# Altium project Task_2.PrjPcb (part 4 of 5)
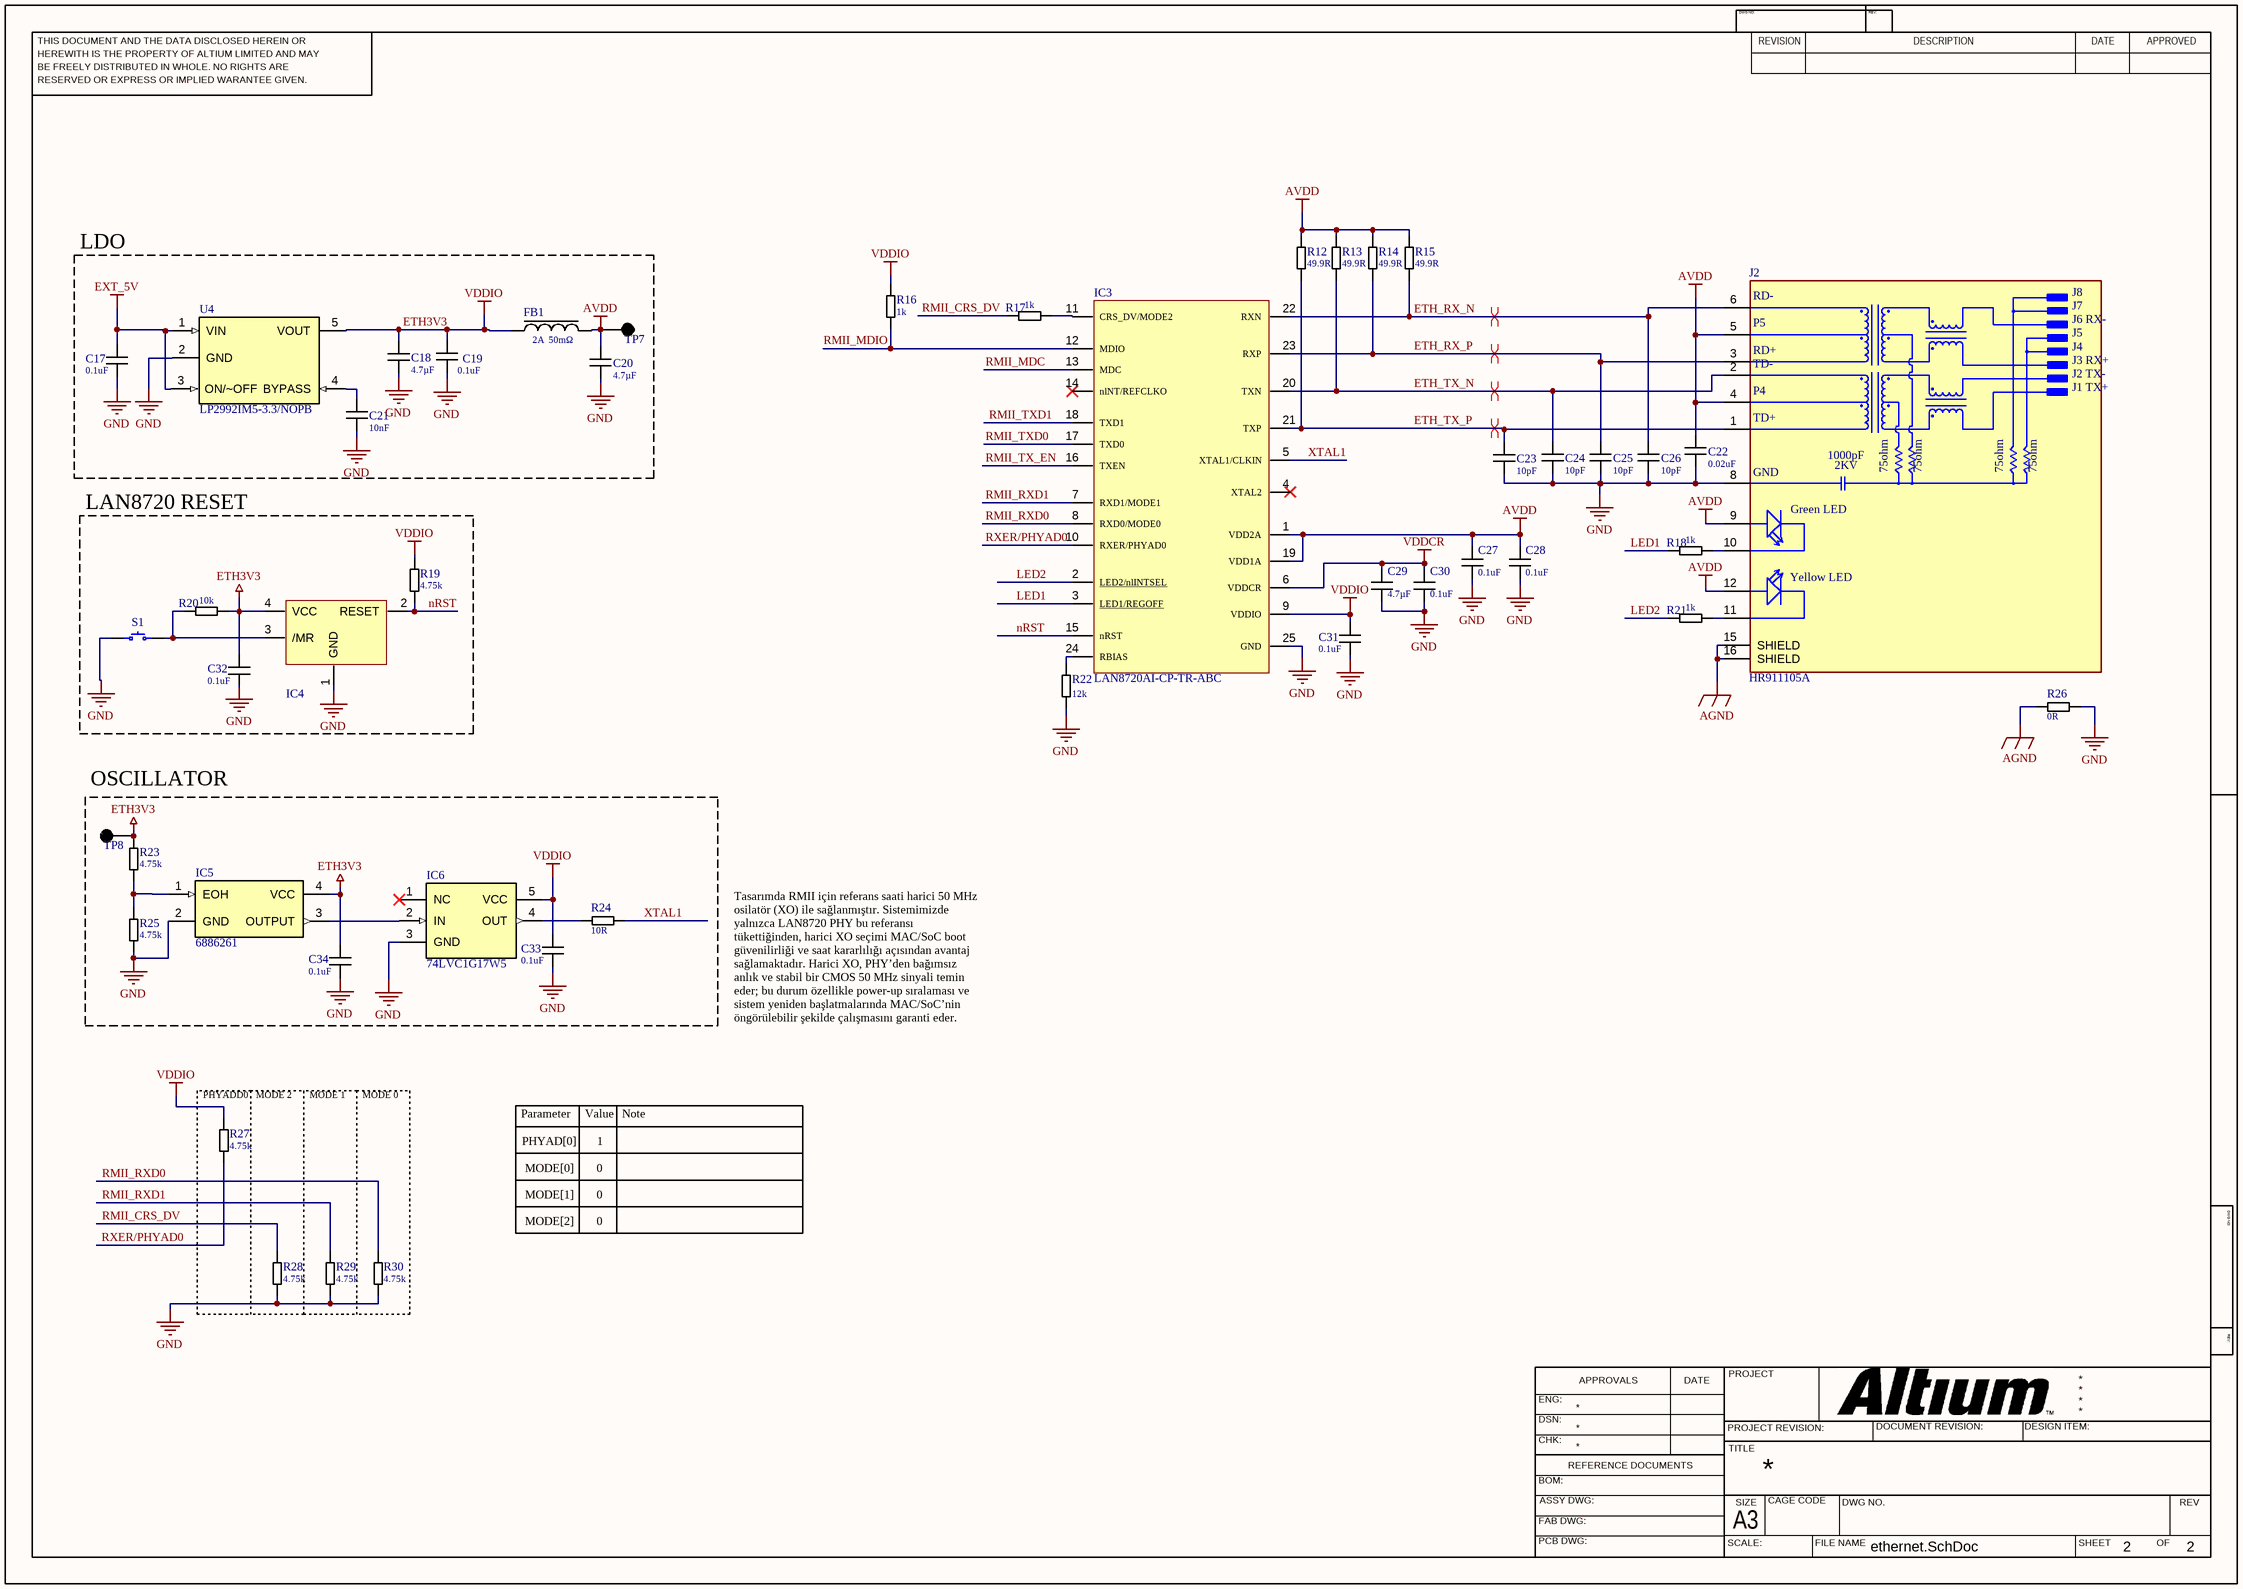
[diagram p4: ethernet.SchDoc]

## Sheet ethernet.SchDoc (continued)
### Library data of the parts
C17 C19 C27 C28 C30-C34 = CAP 0.1uF 0603: Cap Ceramic 0.1uF ±%10 10V SMD 0603; Manufacturer: KEMET; Dielectric: X7R; Dissipation Factor: 5%; Temperature Coefficient: 30ppm/°C; Tolerance: 10%; Supplier 1: Farnell; Manufacturer Part Number: C0603C104K8RACTU; RoHS: Compliant; Category: Ceramic Capacitors; Stock 1: 76000; Pricing 1: 4000=0,0182 (EUR); Case/Package: 0603; Case Code (Imperial): 0603; China RoHS: Compliant; Contact Plating: Tin; Depth: 800µm; Dielectric Material: Ceramic; Height: 800µm; Lead Free: Lead Free; Lead Pitch: 700µm; Length: 1.6mm; Lifecycle Status: Production; Material: Ceramic; Max Operating Temperature: 125°C; Min Operating Temperature: -55°C; Mount: Surface Mount; Number of Pins: 2; Number of Terminals: 2; Packaging: Tape & Reel; Radiation Hardening: No; REACH SVHC: Yes; Schedule B: 8532240020, 8532240020|8532240020, 8532240020|8532240020|8532240020, 8532240020|8532240020|8532240020|8532240020; Termination: SMD/SMT; Thickness: 863.6µm; Voltage: 10V; Voltage Rating: 10V; Voltage Rating (DC): 10V; Width: 800µm; ComponentLink1URL: https://datasheet.octopart.com:443/C0603C104K8RAC7867-KEMET-datasheet-179096319.pdf?src-supplier=IHS; ComponentLink1Description: https://datasheet.octopart.com:443/C0603C104K8RAC7867-KEMET-datasheet-179096319.pdf?src-supplier=IHS; ComponentLink2URL: https://datasheet.octopart.com:443/C0603C104K8RACTU-KEMET-datasheet-178445679.pdf?src-supplier=IHS; ComponentLink2Description: https://datasheet.octopart.com:443/C0603C104K8RACTU-KEMET-datasheet-178445679.pdf?src-supplier=IHS; ComponentLink3URL: https://datasheet.octopart.com:443/C0603C104K8RACTU-KEMET-datasheet-137357759.pdf?src-supplier=Farnell; ComponentLink3Description: https://datasheet.octopart.com:443/C0603C104K8RACTU-KEMET-datasheet-137357759.pdf?src-supplier=Farnell; ComponentLink4URL: https://datasheet.octopart.com:443/C0603C104K8RACTU-KEMET-datasheet-149521868.pdf?src-supplier=Farnell; ComponentLink4Description: https://datasheet.octopart.com:443/C0603C104K8RACTU-KEMET-datasheet-149521868.pdf?src-supplier=Farnell; ComponentLink5URL: https://datasheet.octopart.com:443/C0603C104K8RACTU-KEMET-datasheet-101575656.pdf?src-supplier=Farnell; ComponentLink5Description: https://datasheet.octopart.com:443/C0603C104K8RACTU-KEMET-datasheet-101575656.pdf?src-supplier=Farnell; ComponentLink6URL: https://datasheet.octopart.com:443/C0603C104K8RACTU-KEMET-datasheet-137357764.pdf?src-supplier=Upverter; ComponentLink6Description: https://datasheet.octopart.com:443/C0603C104K8RACTU-KEMET-datasheet-137357764.pdf?src-supplier=Upverter; ComponentLink7URL: https://datasheet.octopart.com:443/C0603C104K8RAC7867-KEMET-datasheet-188512054.pdf?src-supplier=ODG+(Origin+Data+Global); ComponentLink7Description: https://datasheet.octopart.com:443/C0603C104K8RAC7867-KEMET-datasheet-188512054.pdf?src-supplier=ODG+(Origin+Data+Global); ComponentLink8URL: https://datasheet.octopart.com:443/C0603C104K8RACTU-Kemet-datasheet-32036385.pdf?src-supplier=Electro+Sonic; ComponentLink8Description: https://datasheet.octopart.com:443/C0603C104K8RACTU-Kemet-datasheet-32036385.pdf?src-supplier=Electro+Sonic; ComponentLink9URL: https://datasheet.octopart.com:443/C0603C104K8RACTU-KEMET-datasheet-157246124.pdf?src-supplier=Electro+Sonic; ComponentLink9Description: https://datasheet.octopart.com:443/C0603C104K8RACTU-KEMET-datasheet-157246124.pdf?src-supplier=Electro+Sonic; ComponentLink10URL: https://datasheet.octopart.com:443/C0603C104K8RACTU-Kemet-datasheet-12608295.pdf?src-supplier=element14+APAC; ComponentLink10Description: https://datasheet.octopart.com:443/C0603C104K8RACTU-Kemet-datasheet-12608295.pdf?src-supplier=element14+APAC; ComponentLink11URL: https://datasheet.octopart.com:443/C0603C104K8RACTU-Kemet-datasheet-11992184.pdf?src-supplier=element14+APAC; ComponentLink11Description: https://datasheet.octopart.com:443/C0603C104K8RACTU-Kemet-datasheet-11992184.pdf?src-supplier=element14+APAC; ComponentLink12URL: https://datasheet.octopart.com:443/C0603C104K8RACTU-Kemet-datasheet-10942409.pdf?src-supplier=element14+APAC; ComponentLink12Description: https://datasheet.octopart.com:443/C0603C104K8RACTU-Kemet-datasheet-10942409.pdf?src-supplier=element14+APAC; ComponentLink13URL: https://datasheet.octopart.com:443/C0603C104K8RACTU-Kemet-datasheet-10404442.pdf?src-supplier=element14+APAC; ComponentLink13Description: https://datasheet.octopart.com:443/C0603C104K8RACTU-Kemet-datasheet-10404442.pdf?src-supplier=element14+APAC; ComponentLink14URL: https://datasheet.octopart.com:443/C0603C104K8RACTU-Kemet-datasheet-21133259.pdf?src-supplier=element14+APAC; ComponentLink14Description: https://datasheet.octopart.com:443/C0603C104K8RACTU-Kemet-datasheet-21133259.pdf?src-supplier=element14+APAC; ComponentLink15URL: https://datasheet.octopart.com:443/C0603C104K8RACTU-Kemet-datasheet-41232427.pdf?src-supplier=element14+APAC; ComponentLink15Description: https://datasheet.octopart.com:443/C0603C104K8RACTU-Kemet-datasheet-41232427.pdf?src-supplier=element14+APAC; ComponentLink16URL: https://datasheet.octopart.com:443/C0603C104K8RACTU-Kemet-datasheet-5313890.pdf?src-supplier=element14; ComponentLink16Description: https://datasheet.octopart.com:443/C0603C104K8RACTU-Kemet-datasheet-5313890.pdf?src-supplier=element14; ComponentLink17URL: https://datasheet.octopart.com:443/C0603C104K8RACTU-KEMET-datasheet-176142238.pdf?src-supplier=Newark; ComponentLink17Description: https://datasheet.octopart.com:443/C0603C104K8RACTU-KEMET-datasheet-176142238.pdf?src-supplier=Newark; ComponentLink18URL: https://datasheet.octopart.com:443/C0603C104K8RACTU-Kemet-datasheet-27203261.pdf?src-supplier=Newark; ComponentLink18Description: https://datasheet.octopart.com:443/C0603C104K8RACTU-Kemet-datasheet-27203261.pdf?src-supplier=Newark; ComponentLink19URL: https://datasheet.octopart.com:443/C0603C104K8RACTU-KEMET-datasheet-164512540.pdf?src-supplier=TME; ComponentLink19Description: https://datasheet.octopart.com:443/C0603C104K8RACTU-KEMET-datasheet-164512540.pdf?src-supplier=TME; ComponentLink20URL: https://datasheet.octopart.com:443/C0603C104K8RACTU-KEMET-datasheet-96931493.pdf?src-supplier=TME; ComponentLink20Description: https://datasheet.octopart.com:443/C0603C104K8RACTU-KEMET-datasheet-96931493.pdf?src-supplier=TME; ComponentLink21URL: https://datasheet.octopart.com:443/C0603C104K8RACTU-KEMET-datasheet-68331906.pdf?src-supplier=TME; ComponentLink21Description: https://datasheet.octopart.com:443/C0603C104K8RACTU-KEMET-datasheet-68331906.pdf?src-supplier=TME; ComponentLink22URL: https://datasheet.octopart.com:443/C0603C104K8RACTU-KEMET-datasheet-110724412.pdf?src-supplier=RS+(Formerly+Allied+Electronics); ComponentLink22Description: https://datasheet.octopart.com:443/C0603C104K8RACTU-KEMET-datasheet-110724412.pdf?src-supplier=RS+(Formerly+Allied+Electronics); ComponentLink23URL: https://datasheet.octopart.com:443/C0603C104K8RACTU-Kemet-datasheet-464.pdf?src-supplier=RS+(Formerly+Allied+Electronics); ComponentLink23Description: https://datasheet.octopart.com:443/C0603C104K8RACTU-Kemet-datasheet-464.pdf?src-supplier=RS+(Formerly+Allied+Electronics); ComponentLink24URL: https://datasheet.octopart.com/C0603C104K8RACTU-KEMET-datasheet-84169754.pdf; ComponentLink24Description: https://datasheet.octopart.com/C0603C104K8RACTU-KEMET-datasheet-84169754.pdf; ComponentLink25URL: https://datasheet.octopart.com:443/C0603C104K8RAC-TU-Kemet-datasheet-8204392.pdf?src-supplier=Jameco; ComponentLink25Description: https://datasheet.octopart.com:443/C0603C104K8RAC-TU-Kemet-datasheet-8204392.pdf?src-supplier=Jameco; Supplier Part Number 1: 2665559
C18 C20 C29 = CAP 4.7uF 0603: Cap Ceramic 4.7uF ±%10  10V SMD 0603; Manufacturer: Yageo Group; Dielectric: X5R; Tolerance: 10%; Supplier 1: Farnell; Manufacturer Part Number: CC0603KRX5R6BB475; RoHS: Compliant; Category: Ceramic Capacitors; Stock 1: 140000; Pricing 1: 4000=0,0354 (EUR); Case/Package: 0603; Case Code (Imperial): 0603; Case Code (Metric): 1608; China RoHS: Compliant; Composition: Ceramic; Depth: 800µm; Dielectric Material: Ceramic; Halogen Free: Halogen Free; Height: 800µm; Lead Free: Lead Free; Length: 1.6mm; Lifecycle Status: Production; Material: Ceramic; Max Operating Temperature: 85°C; Min Operating Temperature: -55°C; Mount: Surface Mount; Number of Pins: 2; Number of Terminals: 2; Radiation Hardening: No; REACH SVHC: Yes; Schedule B: 8532240020, 8532240020|8532240020|8532240020|8532240020|8532240020; Termination: SMD/SMT; Thickness: 889µm; Voltage Rating: 10V; Voltage Rating (DC): 10V; Width: 800µm; ComponentLink1URL: https://datasheet.octopart.com:443/CC0603KRX5R6BB475-Yageo-datasheet-170350636.pdf?src-supplier=IHS; ComponentLink1Description: https://datasheet.octopart.com:443/CC0603KRX5R6BB475-Yageo-datasheet-170350636.pdf?src-supplier=IHS; ComponentLink2URL: https://datasheet.octopart.com/CC0603KRX5R6BB475-Yageo-datasheet-86397281.pdf; ComponentLink2Description: https://datasheet.octopart.com/CC0603KRX5R6BB475-Yageo-datasheet-86397281.pdf; ComponentLink3URL: https://datasheet.octopart.com:443/CC0603KRX5R6BB475-Yageo-datasheet-82288757.pdf?src-supplier=Upverter; ComponentLink3Description: https://datasheet.octopart.com:443/CC0603KRX5R6BB475-Yageo-datasheet-82288757.pdf?src-supplier=Upverter; ComponentLink4URL: https://datasheet.octopart.com:443/CC0603KRX5R6BB475-Yageo-datasheet-10911834.pdf?src-supplier=element14+APAC; ComponentLink4Description: https://datasheet.octopart.com:443/CC0603KRX5R6BB475-Yageo-datasheet-10911834.pdf?src-supplier=element14+APAC; ComponentLink5URL: https://datasheet.octopart.com:443/CC0603KRX5R6BB475-Yageo-datasheet-62067349.pdf?src-supplier=element14+APAC; ComponentLink5Description: https://datasheet.octopart.com:443/CC0603KRX5R6BB475-Yageo-datasheet-62067349.pdf?src-supplier=element14+APAC; ComponentLink6URL: https://datasheet.octopart.com:443/CC0603KRX5R6BB475-Yageo-datasheet-181968526.pdf?src-supplier=Farnell; ComponentLink6Description: https://datasheet.octopart.com:443/CC0603KRX5R6BB475-Yageo-datasheet-181968526.pdf?src-supplier=Farnell; ComponentLink7URL: https://datasheet.octopart.com:443/CC0603KRX5R6BB475-Phycomp-datasheet-519481.pdf?src-supplier=Farnell; ComponentLink7Description: https://datasheet.octopart.com:443/CC0603KRX5R6BB475-Phycomp-datasheet-519481.pdf?src-supplier=Farnell; ComponentLink8URL: https://datasheet.octopart.com:443/CC0603KRX5R6BB475-Yageo-datasheet-158238148.pdf?src-supplier=Newark; ComponentLink8Description: https://datasheet.octopart.com:443/CC0603KRX5R6BB475-Yageo-datasheet-158238148.pdf?src-supplier=Newark; ComponentLink9URL: https://datasheet.octopart.com:443/CC0603KRX5R6BB475-Yageo-datasheet-8324442.pdf?src-supplier=Newark; ComponentLink9Description: https://datasheet.octopart.com:443/CC0603KRX5R6BB475-Yageo-datasheet-8324442.pdf?src-supplier=Newark; ComponentLink10URL: https://datasheet.octopart.com:443/CC0603KRX5R6BB475-Yageo-datasheet-149070021.pdf?src-supplier=TME; ComponentLink10Description: https://datasheet.octopart.com:443/CC0603KRX5R6BB475-Yageo-datasheet-149070021.pdf?src-supplier=TME; ComponentLink11URL: https://datasheet.octopart.com:443/CC0603KRX5R6BB475-Yageo-Group-datasheet-145016144.pdf?src-supplier=ODG+(Origin+Data+Global); ComponentLink11Description: https://datasheet.octopart.com:443/CC0603KRX5R6BB475-Yageo-Group-datasheet-145016144.pdf?src-supplier=ODG+(Origin+Data+Global); ComponentLink12URL: https://datasheet.octopart.com:443/CC0603KRX5R6BB475-Yageo-datasheet-137875056.pdf?src-supplier=Future+Electronics; ComponentLink12Description: https://datasheet.octopart.com:443/CC0603KRX5R6BB475-Yageo-datasheet-137875056.pdf?src-supplier=Future+Electronics; ComponentLink13URL: https://datasheet.octopart.com:443/CC0603KRX5R6BB475-Yageo-datasheet-137700082.pdf?src-supplier=Future+Electronics; ComponentLink13Description: https://datasheet.octopart.com:443/CC0603KRX5R6BB475-Yageo-datasheet-137700082.pdf?src-supplier=Future+Electronics; ComponentLink14URL: https://datasheet.octopart.com:443/CC0603KRX5R6BB475-Yageo-datasheet-137700085.pdf?src-supplier=Future+Electronics; ComponentLink14Description: https://datasheet.octopart.com:443/CC0603KRX5R6BB475-Yageo-datasheet-137700085.pdf?src-supplier=Future+Electronics; ComponentLink15URL: https://datasheet.octopart.com:443/CC0603KRX5R6BB475-Yageo-datasheet-59875459.pdf?src-supplier=Future+Electronics; ComponentLink15Description: https://datasheet.octopart.com:443/CC0603KRX5R6BB475-Yageo-datasheet-59875459.pdf?src-supplier=Future+Electronics; ComponentLink16URL: https://datasheet.octopart.com:443/CC0603KRX5R6BB475-Yageo-datasheet-27626583.pdf?src-supplier=Future+Electronics; ComponentLink16Description: https://datasheet.octopart.com:443/CC0603KRX5R6BB475-Yageo-datasheet-27626583.pdf?src-supplier=Future+Electronics; ComponentLink17URL: https://datasheet.octopart.com:443/CC0603KRX5R6BB475-Yageo-datasheet-15895757.pdf?src-supplier=Future+Electronics; ComponentLink17Description: https://datasheet.octopart.com:443/CC0603KRX5R6BB475-Yageo-datasheet-15895757.pdf?src-supplier=Future+Electronics; ComponentLink18URL: https://datasheet.octopart.com:443/CC0603KRX5R6BB475-Yageo-datasheet-14389981.pdf?src-supplier=Future+Electronics; ComponentLink18Description: https://datasheet.octopart.com:443/CC0603KRX5R6BB475-Yageo-datasheet-14389981.pdf?src-supplier=Future+Electronics; ComponentLink19URL: http://sigma.octopart.com:80/rohs_statement/Yageo-company-2.pdf?src-supplier=Compliance+Statements; ComponentLink19Description: http://sigma.octopart.com:80/rohs_statement/Yageo-company-2.pdf?src-supplier=Compliance+Statements; ComponentLink20URL: http://sigma.octopart.com:80/conflict_mineral_statement/Yageo-company-3.pdf?src-supplier=Compliance+Statements; ComponentLink20Description: http://sigma.octopart.com:80/conflict_mineral_statement/Yageo-company-3.pdf?src-supplier=Compliance+Statements; Supplier Part Number 1: 3871732
C21 = CAP 0.01uF 0603: Cap Ceramic 0.01uF ±%20 50V SMD 0603; Manufacturer: KYOCERA AVX; Dielectric: X7R; Dissipation Factor: 2.5%; Tolerance: 20%; Supplier 1: Mouser; Manufacturer Part Number: 06035C103MAZ2A; RoHS: Compliant; Category: Ceramic Capacitors; Stock 1: 17787; Pricing 1: 1=0,1, 10=0,029, 50=0,029, 100=0,025, 1000=0,016, 10000=0,010 (USD); Case/Package: 0603; Case Code (Imperial): 0603; Case Code (Metric): 1608; China RoHS: Compliant; Dielectric Material: Ceramic; Height: 900µm; Length: 1.6mm; Lifecycle Status: Production; Material: Ceramic; Max Operating Temperature: 125°C; Min Operating Temperature: -55°C; Mount: Surface Mount; Number of Terminals: 2; REACH SVHC: Yes; Schedule B: 8532240020; Termination: SMD/SMT; Voltage Rating: 50V; Voltage Rating (DC): 50V; Width: 810µm; ComponentLink1URL: https://datasheet.octopart.com:443/06035C103MAZ2A-KYOCERA-AVX-datasheet-170560559.pdf?src-supplier=IHS; ComponentLink1Description: https://datasheet.octopart.com:443/06035C103MAZ2A-KYOCERA-AVX-datasheet-170560559.pdf?src-supplier=IHS; ComponentLink2URL: https://sigma.octopart.com:443/147443767/technical_drawing/AVX-06035C103MAZ2A.pdf?src-supplier=Upverter; ComponentLink2Description: https://sigma.octopart.com:443/147443767/technical_drawing/AVX-06035C103MAZ2A.pdf?src-supplier=Upverter; ComponentLink3URL: https://datasheet.octopart.com:443/06035C103MAZ2A-KYOCERA-AVX-datasheet-156093841.pdf?src-supplier=Future+Electronics; ComponentLink3Description: https://datasheet.octopart.com:443/06035C103MAZ2A-KYOCERA-AVX-datasheet-156093841.pdf?src-supplier=Future+Electronics; ComponentLink4URL: https://datasheet.octopart.com/06035C103MAZ2A-KYOCERA-AVX-datasheet-13516023.pdf; ComponentLink4Description: https://datasheet.octopart.com/06035C103MAZ2A-KYOCERA-AVX-datasheet-13516023.pdf; ComponentLink5URL: https://datasheet.octopart.com/Commercial-Surface-Mount-Chips---X7R-Dielectric-AVX-datasheet-family-100.pdf; ComponentLink5Description: https://datasheet.octopart.com/Commercial-Surface-Mount-Chips---X7R-Dielectric-AVX-datasheet-family-100.pdf; ComponentLink6URL: http://sigma.octopart.com:80/reach_statement/AVX-company-19.pdf?src-supplier=Compliance+Statements; ComponentLink6Description: http://sigma.octopart.com:80/reach_statement/AVX-company-19.pdf?src-supplier=Compliance+Statements; ComponentLink7URL: http://sigma.octopart.com:80/conflict_mineral_statement/AVX-company-34.pdf?src-supplier=Compliance+Statements; ComponentLink7Description: http://sigma.octopart.com:80/conflict_mineral_statement/AVX-company-34.pdf?src-supplier=Compliance+Statements; Supplier Part Number 1: 581-06035C103MAZ2A
C22 = CAP 0.02uF 0603: Cap Ceramic 0.02 uF 10 V ±%10 SMD 0603; Manufacturer: KYOCERA AVX; Manufacturer Part Number: 0603ZC223KAT2A; Dielectric: X7R; Dissipation Factor: 5%; Tolerance: 10%; Voltage Rating: 10V; Supplier 1: Future Electronics; RoHS: Compliant; Category: Ceramic Capacitors; Stock 1: 68000; Pricing 1: 4000=0,0057, 16000=0,0055, 40000=0,0053, 100000=0,0052, 160000=0,0049 (USD); Case/Package: 0603; Case Code (Imperial): 0603; Case Code (Metric): 1608; China RoHS: Compliant; Depth: 810µm; Dielectric Material: Ceramic; Height: 900µm; Lead Free: Lead Free; Length: 1.6mm; Lifecycle Status: Production; Max Operating Temperature: 125°C; Min Operating Temperature: -55°C; Mount: Surface Mount; Number of Pins: 2; Number of Terminals: 2; Radiation Hardening: No; REACH SVHC: Yes; Schedule B: 8532240020; Termination: SMD/SMT; Thickness: 889µm; Voltage Rating (DC): 10V; Width: 810µm; ComponentLink1URL: https://datasheet.octopart.com:443/0603ZC223KAT2A-KYOCERA-AVX-datasheet-170560559.pdf?src-supplier=IHS; ComponentLink1Description: https://datasheet.octopart.com:443/0603ZC223KAT2A-KYOCERA-AVX-datasheet-170560559.pdf?src-supplier=IHS; ComponentLink2URL: https://datasheet.octopart.com:443/0603ZC223KAT2A-KYOCERA-AVX-datasheet-158983632.pdf?src-supplier=Newark; ComponentLink2Description: https://datasheet.octopart.com:443/0603ZC223KAT2A-KYOCERA-AVX-datasheet-158983632.pdf?src-supplier=Newark; ComponentLink3URL: https://datasheet.octopart.com:443/0603ZC223KAT2A-AVX-datasheet-78690206.pdf?src-supplier=Newark; ComponentLink3Description: https://datasheet.octopart.com:443/0603ZC223KAT2A-AVX-datasheet-78690206.pdf?src-supplier=Newark; ComponentLink4URL: https://datasheet.octopart.com:443/0603ZC223KAT2A-KYOCERA-AVX-datasheet-8447489.pdf?src-supplier=Newark; ComponentLink4Description: https://datasheet.octopart.com:443/0603ZC223KAT2A-KYOCERA-AVX-datasheet-8447489.pdf?src-supplier=Newark; ComponentLink5URL: https://datasheet.octopart.com:443/0603ZC223KAT2A-KYOCERA-AVX-datasheet-50865067.pdf?src-supplier=Future+Electronics; ComponentLink5Description: https://datasheet.octopart.com:443/0603ZC223KAT2A-KYOCERA-AVX-datasheet-50865067.pdf?src-supplier=Future+Electronics; ComponentLink6URL: https://datasheet.octopart.com:443/0603ZC223KAT2A-AVX-datasheet-12587061.pdf?src-supplier=Future+Electronics; ComponentLink6Description: https://datasheet.octopart.com:443/0603ZC223KAT2A-AVX-datasheet-12587061.pdf?src-supplier=Future+Electronics; ComponentLink7URL: https://datasheet.octopart.com:443/0603ZC223KAT2A-AVX-datasheet-12509786.pdf?src-supplier=Future+Electronics; ComponentLink7Description: https://datasheet.octopart.com:443/0603ZC223KAT2A-AVX-datasheet-12509786.pdf?src-supplier=Future+Electronics; ComponentLink8URL: https://datasheet.octopart.com:443/0603ZC223KAT2A-AVX-datasheet-8113618.pdf?src-supplier=Future+Electronics; ComponentLink8Description: https://datasheet.octopart.com:443/0603ZC223KAT2A-AVX-datasheet-8113618.pdf?src-supplier=Future+Electronics; ComponentLink9URL: https://datasheet.octopart.com:443/0603ZC223KAT2A-AVX-datasheet-5313617.pdf?src-supplier=Future+Electronics; ComponentLink9Description: https://datasheet.octopart.com:443/0603ZC223KAT2A-AVX-datasheet-5313617.pdf?src-supplier=Future+Electronics; ComponentLink10URL: https://datasheet.octopart.com:443/0603ZC223KAT2A-AVX-datasheet-167033.pdf?src-supplier=Future+Electronics; ComponentLink10Description: https://datasheet.octopart.com:443/0603ZC223KAT2A-AVX-datasheet-167033.pdf?src-supplier=Future+Electronics; ComponentLink11URL: https://datasheet.octopart.com/0603ZC223KAT2A-AVX---Kyocera-datasheet-13516023.pdf; ComponentLink11Description: https://datasheet.octopart.com/0603ZC223KAT2A-AVX---Kyocera-datasheet-13516023.pdf; ComponentLink12URL: https://datasheet.octopart.com:443/0603ZC223KAT2A-AVX-datasheet-111406.pdf?src-supplier=Sierra+IC; ComponentLink12Description: https://datasheet.octopart.com:443/0603ZC223KAT2A-AVX-datasheet-111406.pdf?src-supplier=Sierra+IC; ComponentLink13URL: http://sigma.octopart.com:80/reach_statement/AVX-company-19.pdf?src-supplier=Compliance+Statements; ComponentLink13Description: http://sigma.octopart.com:80/reach_statement/AVX-company-19.pdf?src-supplier=Compliance+Statements; ComponentLink14URL: http://sigma.octopart.com:80/conflict_mineral_statement/AVX-company-34.pdf?src-supplier=Compliance+Statements; ComponentLink14Description: http://sigma.octopart.com:80/conflict_mineral_statement/AVX-company-34.pdf?src-supplier=Compliance+Statements; Supplier Part Number 1: 8054082
C23-C26 = CAP 10pF 0603: Cap Ceramic 10pF  ±5 50V SMD 0603; Manufacturer: Yageo Group; Dielectric: C0G; Insulation Resistance: 100GΩ; Temperature Coefficient: 30ppm/°C; Tolerance: 5%; Supplier 1: Farnell; Manufacturer Part Number: CC0603JRNPO9BN100; RoHS: Compliant; Category: Ceramic Capacitors; Stock 1: 1398662; Pricing 1: 10=0,0182, 100=0,0156, 500=0,0113, 1000=0,0087, 2000=0,0082, 4000=0,0077 (EUR); Case/Package: 0603; Case Code (Imperial): 0603; Case Code (Metric): 1608; China RoHS: Compliant; Composition: Ceramic; Depth: 800µm; Dielectric Material: Ceramic; Halogen Free: Halogen Free; Height: 800µm; Lead Free: Lead Free; Length: 1.6mm; Lifecycle Status: Production; Max Operating Temperature: 125°C; Min Operating Temperature: -55°C; Mount: Surface Mount; Number of Pins: 2; Number of Terminals: 2; Radiation Hardening: No; REACH SVHC: Yes; Schedule B: 8532240020, 8532240020|8532240020, 8532240020|8532240020|8532240020, 8532240020|8532240020|8532240020|8532240020; Termination: SMD/SMT; Thickness: 889µm; Voltage: 50V; Voltage Rating: 50V; Voltage Rating (DC): 50V; Width: 800µm; ComponentLink1URL: https://datasheet.octopart.com:443/CC0603JRNPO9BN100-Yageo-datasheet-182140217.pdf?src-supplier=IHS; ComponentLink1Description: https://datasheet.octopart.com:443/CC0603JRNPO9BN100-Yageo-datasheet-182140217.pdf?src-supplier=IHS; ComponentLink2URL: https://datasheet.octopart.com:443/CC0603JRNPO9BN100-Yageo-datasheet-78855684.pdf?src-supplier=Upverter; ComponentLink2Description: https://datasheet.octopart.com:443/CC0603JRNPO9BN100-Yageo-datasheet-78855684.pdf?src-supplier=Upverter; ComponentLink3URL: https://datasheet.octopart.com:443/CC0603JRNPO9BN100-Yageo-datasheet-10406438.pdf?src-supplier=element14+APAC; ComponentLink3Description: https://datasheet.octopart.com:443/CC0603JRNPO9BN100-Yageo-datasheet-10406438.pdf?src-supplier=element14+APAC; ComponentLink4URL: https://datasheet.octopart.com:443/CC0603JRNPO9BN100-Yageo-datasheet-151948684.pdf?src-supplier=element14+APAC; ComponentLink4Description: https://datasheet.octopart.com:443/CC0603JRNPO9BN100-Yageo-datasheet-151948684.pdf?src-supplier=element14+APAC; ComponentLink5URL: https://datasheet.octopart.com:443/CC0603JRNPO9BN100-Yageo-datasheet-65873193.pdf?src-supplier=element14+APAC; ComponentLink5Description: https://datasheet.octopart.com:443/CC0603JRNPO9BN100-Yageo-datasheet-65873193.pdf?src-supplier=element14+APAC; ComponentLink6URL: https://datasheet.octopart.com:443/CC0603JRNPO9BN100-Yageo-datasheet-67645495.pdf?src-supplier=element14+APAC; ComponentLink6Description: https://datasheet.octopart.com:443/CC0603JRNPO9BN100-Yageo-datasheet-67645495.pdf?src-supplier=element14+APAC; ComponentLink7URL: https://datasheet.octopart.com:443/CC0603JRNPO9BN100-Yageo-datasheet-10882999.pdf?src-supplier=element14+APAC; ComponentLink7Description: https://datasheet.octopart.com:443/CC0603JRNPO9BN100-Yageo-datasheet-10882999.pdf?src-supplier=element14+APAC; ComponentLink8URL: https://datasheet.octopart.com:443/CC0603JRNPO9BN100-Yageo-datasheet-504625.pdf?src-supplier=Newark; ComponentLink8Description: https://datasheet.octopart.com:443/CC0603JRNPO9BN100-Yageo-datasheet-504625.pdf?src-supplier=Newark; ComponentLink9URL: https://datasheet.octopart.com:443/CC0603JRNPO9BN100-Yageo-datasheet-181968161.pdf?src-supplier=Newark; ComponentLink9Description: https://datasheet.octopart.com:443/CC0603JRNPO9BN100-Yageo-datasheet-181968161.pdf?src-supplier=Newark; ComponentLink10URL: https://datasheet.octopart.com:443/CC0603JRNPO9BN100-Yageo-datasheet-181968159.pdf?src-supplier=Newark; ComponentLink10Description: https://datasheet.octopart.com:443/CC0603JRNPO9BN100-Yageo-datasheet-181968159.pdf?src-supplier=Newark; ComponentLink11URL: https://datasheet.octopart.com:443/CC0603JRNPO9BN100-Yageo-datasheet-5321569.pdf?src-supplier=Newark; ComponentLink11Description: https://datasheet.octopart.com:443/CC0603JRNPO9BN100-Yageo-datasheet-5321569.pdf?src-supplier=Newark; ComponentLink12URL: https://datasheet.octopart.com:443/CC0603JRNPO9BN100-Yageo-datasheet-137875056.pdf?src-supplier=Future+Electronics; ComponentLink12Description: https://datasheet.octopart.com:443/CC0603JRNPO9BN100-Yageo-datasheet-137875056.pdf?src-supplier=Future+Electronics; ComponentLink13URL: https://datasheet.octopart.com:443/CC0603JRNPO9BN100-Yageo-datasheet-136957424.pdf?src-supplier=Future+Electronics; ComponentLink13Description: https://datasheet.octopart.com:443/CC0603JRNPO9BN100-Yageo-datasheet-136957424.pdf?src-supplier=Future+Electronics; ComponentLink14URL: https://datasheet.octopart.com:443/CC0603JRNPO9BN100-Yageo-datasheet-137700082.pdf?src-supplier=Future+Electronics; ComponentLink14Description: https://datasheet.octopart.com:443/CC0603JRNPO9BN100-Yageo-datasheet-137700082.pdf?src-supplier=Future+Electronics; ComponentLink15URL: https://datasheet.octopart.com:443/CC0603JRNPO9BN100-Yageo-datasheet-62091628.pdf?src-supplier=Future+Electronics; ComponentLink15Description: https://datasheet.octopart.com:443/CC0603JRNPO9BN100-Yageo-datasheet-62091628.pdf?src-supplier=Future+Electronics; ComponentLink16URL: https://datasheet.octopart.com:443/CC0603JRNPO9BN100-Yageo-datasheet-24578986.pdf?src-supplier=Future+Electronics; ComponentLink16Description: https://datasheet.octopart.com:443/CC0603JRNPO9BN100-Yageo-datasheet-24578986.pdf?src-supplier=Future+Electronics; ComponentLink17URL: https://datasheet.octopart.com:443/CC0603JRNPO9BN100-Yageo-datasheet-16730043.pdf?src-supplier=Future+Electronics; ComponentLink17Description: https://datasheet.octopart.com:443/CC0603JRNPO9BN100-Yageo-datasheet-16730043.pdf?src-supplier=Future+Electronics; ComponentLink18URL: https://datasheet.octopart.com:443/CC0603JRNPO9BN100-Yageo-datasheet-15895757.pdf?src-supplier=Future+Electronics; ComponentLink18Description: https://datasheet.octopart.com:443/CC0603JRNPO9BN100-Yageo-datasheet-15895757.pdf?src-supplier=Future+Electronics; ComponentLink19URL: https://datasheet.octopart.com:443/CC0603JRNPO9BN100-Yageo-datasheet-12589826.pdf?src-supplier=Future+Electronics; ComponentLink19Description: https://datasheet.octopart.com:443/CC0603JRNPO9BN100-Yageo-datasheet-12589826.pdf?src-supplier=Future+Electronics; ComponentLink20URL: https://datasheet.octopart.com:443/CC0603JRNPO9BN100-Yageo-Group-datasheet-188689709.pdf?src-supplier=Farnell; ComponentLink20Description: https://datasheet.octopart.com:443/CC0603JRNPO9BN100-Yageo-Group-datasheet-188689709.pdf?src-supplier=Farnell; ComponentLink21URL: https://datasheet.octopart.com:443/CC0603JRNPO9BN100-Yageo-datasheet-8817079.pdf?src-supplier=element14; ComponentLink21Description: https://datasheet.octopart.com:443/CC0603JRNPO9BN100-Yageo-datasheet-8817079.pdf?src-supplier=element14; ComponentLink22URL: https://datasheet.octopart.com:443/CC0603JRNPO9BN100-Yageo-datasheet-8324240.pdf?src-supplier=element14; ComponentLink22Description: https://datasheet.octopart.com:443/CC0603JRNPO9BN100-Yageo-datasheet-8324240.pdf?src-supplier=element14; ComponentLink23URL: https://datasheet.octopart.com:443/CC0603JRNPO9BN100-Yageo-datasheet-8643175.pdf?src-supplier=SOS+electronic; ComponentLink23Description: https://datasheet.octopart.com:443/CC0603JRNPO9BN100-Yageo-datasheet-8643175.pdf?src-supplier=SOS+electronic; ComponentLink24URL: https://datasheet.octopart.com:443/CC0603JRNPO9BN100-Yageo-datasheet-8555986.pdf?src-supplier=TME; ComponentLink24Description: https://datasheet.octopart.com:443/CC0603JRNPO9BN100-Yageo-datasheet-8555986.pdf?src-supplier=TME; ComponentLink25URL: https://datasheet.octopart.com:443/CC0603JRNPO9BN100-Yageo-datasheet-68296204.pdf?src-supplier=Megastar; ComponentLink25Description: https://datasheet.octopart.com:443/CC0603JRNPO9BN100-Yageo-datasheet-68296204.pdf?src-supplier=Megastar; ComponentLink26URL: http://sigma.octopart.com:80/rohs_statement/Yageo-company-2.pdf?src-supplier=Compliance+Statements; ComponentLink26Description: http://sigma.octopart.com:80/rohs_statement/Yageo-company-2.pdf?src-supplier=Compliance+Statements; ComponentLink27URL: http://sigma.octopart.com:80/conflict_mineral_statement/Yageo-company-3.pdf?src-supplier=Compliance+Statements; ComponentLink27Description: http://sigma.octopart.com:80/conflict_mineral_statement/Yageo-company-3.pdf?src-supplier=Compliance+Statements; Supplier Part Number 1: 721967
FB1 = Ferrite Bead 0603 - 120Ohms 2A 50mOhm: Ferrite Beads Multi-Layer 120Ohm 25% 100MHz 2A 50mOhm DCR 0603 Paper T/R; Manufacturer: Murata; Current Rating: 1A; Impedance: 120Ω; Material: Ferrite, Steel; Number of Circuits: 1; Shielding: Unshielded; Supplier 1: Arrow Electronics; Manufacturer Part Number: BLM18PG121SN1D; RoHS: Compliant; Category: Ferrite Beads and Chips; Stock 1: 924000; Pricing 1: 4000=0,0193, 8000=0,016 (USD); Case/Package: 0603; Case Code (Imperial): 0603; Case Code (Metric): 1608; Core Material: Ferrite; Depth: 800µm; Frequency: 100MHz; Height: 800µm; Lead Free: Lead Free; Length: 1.6mm; Lifecycle Status: Production; Max Current Rating: 2A; Max DC Current: 2A; Max Frequency: 100MHz; Max Operating Temperature: 125°C; Min Operating Temperature: -55°C; Number of Lines: 1; Number of Pins: 2; Number of Terminals: 2; Packaging: Cut Tape; Radiation Hardening: No; REACH SVHC: Yes; Resistance: 50mΩ; RMS Current (Irms): 2A; Schedule B: 8504500000, 8504500000|8504500000|8504500000|8504500000|8504500000; Series Resistance: 50mΩ; Termination: SMD/SMT; Test Frequency: 100MHz; Tolerance: 25%; Width: 800µm; ComponentLink1URL: https://datasheet.octopart.com:443/BLM18PG121SN1D-Murata-datasheet-180806579.pdf?src-supplier=IHS; ComponentLink1Description: https://datasheet.octopart.com:443/BLM18PG121SN1D-Murata-datasheet-180806579.pdf?src-supplier=IHS; ComponentLink2URL: https://datasheet.octopart.com:443/BLM18PG121SN1D-Murata-datasheet-35449.pdf?src-supplier=Upverter; ComponentLink2Description: https://datasheet.octopart.com:443/BLM18PG121SN1D-Murata-datasheet-35449.pdf?src-supplier=Upverter; ComponentLink3URL: https://datasheet.octopart.com:443/BLM18PG121SN1D-Murata-datasheet-141439065.pdf?src-supplier=Upverter; ComponentLink3Description: https://datasheet.octopart.com:443/BLM18PG121SN1D-Murata-datasheet-141439065.pdf?src-supplier=Upverter; ComponentLink4URL: https://datasheet.octopart.com:443/BLM18PG121SN1D-Murata-datasheet-11754816.pdf?src-supplier=element14+APAC; ComponentLink4Description: https://datasheet.octopart.com:443/BLM18PG121SN1D-Murata-datasheet-11754816.pdf?src-supplier=element14+APAC; ComponentLink5URL: https://datasheet.octopart.com:443/BLM18PG121SN1D-Murata-datasheet-8326388.pdf?src-supplier=_legacy+Avnet; ComponentLink5Description: https://datasheet.octopart.com:443/BLM18PG121SN1D-Murata-datasheet-8326388.pdf?src-supplier=_legacy+Avnet; ComponentLink6URL: https://datasheet.octopart.com:443/BLM18PG121SN1D-Murata-datasheet-503348.pdf?src-supplier=_legacy+Avnet; ComponentLink6Description: https://datasheet.octopart.com:443/BLM18PG121SN1D-Murata-datasheet-503348.pdf?src-supplier=_legacy+Avnet; ComponentLink7URL: https://datasheet.octopart.com:443/BLM18PG121SN1D-Murata-datasheet-141258021.pdf?src-supplier=Ciiva; ComponentLink7Description: https://datasheet.octopart.com:443/BLM18PG121SN1D-Murata-datasheet-141258021.pdf?src-supplier=Ciiva; ComponentLink8URL: https://datasheet.octopart.com:443/BLM18PG121SN1D-Murata-datasheet-138707164.pdf?src-supplier=Ciiva; ComponentLink8Description: https://datasheet.octopart.com:443/BLM18PG121SN1D-Murata-datasheet-138707164.pdf?src-supplier=Ciiva; ComponentLink9URL: https://datasheet.octopart.com:443/BLM18PG121SN1D-Murata-datasheet-135086698.pdf?src-supplier=TME; ComponentLink9Description: https://datasheet.octopart.com:443/BLM18PG121SN1D-Murata-datasheet-135086698.pdf?src-supplier=TME; ComponentLink10URL: https://datasheet.octopart.com:443/BLM18PG121SN1D-Murata-datasheet-62117746.pdf?src-supplier=TME; ComponentLink10Description: https://datasheet.octopart.com:443/BLM18PG121SN1D-Murata-datasheet-62117746.pdf?src-supplier=TME; ComponentLink11URL: https://datasheet.octopart.com:443/BLM18PG121SN1D-Murata-datasheet-120101182.pdf?src-supplier=Megastar; ComponentLink11Description: https://datasheet.octopart.com:443/BLM18PG121SN1D-Murata-datasheet-120101182.pdf?src-supplier=Megastar; ComponentLink12URL: https://datasheet.octopart.com:443/BLM18PG121SN1D-Murata-datasheet-78375072.pdf?src-supplier=Future+Electronics; ComponentLink12Description: https://datasheet.octopart.com:443/BLM18PG121SN1D-Murata-datasheet-78375072.pdf?src-supplier=Future+Electronics; ComponentLink13URL: https://datasheet.octopart.com:443/BLM18PG121SN1D-Murata-datasheet-62086336.pdf?src-supplier=Future+Electronics; ComponentLink13Description: https://datasheet.octopart.com:443/BLM18PG121SN1D-Murata-datasheet-62086336.pdf?src-supplier=Future+Electronics; ComponentLink14URL: https://datasheet.octopart.com/BLM18PG121SN1D-Murata-datasheet-37129980.pdf; ComponentLink14Description: https://datasheet.octopart.com/BLM18PG121SN1D-Murata-datasheet-37129980.pdf; ComponentLink15URL: https://datasheet.octopart.com:443/BLM18PG121SN1D-Murata-datasheet-14066459.pdf?src-supplier=iiiC; ComponentLink15Description: https://datasheet.octopart.com:443/BLM18PG121SN1D-Murata-datasheet-14066459.pdf?src-supplier=iiiC; ComponentLink16URL: https://datasheet.octopart.com:443/BLM18PG121SN1D-Murata-datasheet-5394615.pdf?src-supplier=Verical; ComponentLink16Description: https://datasheet.octopart.com:443/BLM18PG121SN1D-Murata-datasheet-5394615.pdf?src-supplier=Verical; ComponentLink17URL: https://datasheet.octopart.com:443/BLM18PG121SN1D-Murata-datasheet-7623654.pdf?src-supplier=Jameco; ComponentLink17Description: https://datasheet.octopart.com:443/BLM18PG121SN1D-Murata-datasheet-7623654.pdf?src-supplier=Jameco; ComponentLink18URL: https://datasheet.octopart.com:443/BLM18PG121SN1D-Murata-datasheet-41253.pdf?src-supplier=RS+(Formerly+Allied+Electronics); ComponentLink18Description: https://datasheet.octopart.com:443/BLM18PG121SN1D-Murata-datasheet-41253.pdf?src-supplier=RS+(Formerly+Allied+Electronics); ComponentLink19URL: http://sigma.octopart.com:80/reach_statement/Murata-company-16.pdf?src-supplier=Compliance+Statements; ComponentLink19Description: http://sigma.octopart.com:80/reach_statement/Murata-company-16.pdf?src-supplier=Compliance+Statements; Supplier Part Number 1: BLM18PG121SN1D
IC3 = LAN8720AI-CP-TR-ABC: Small Footprint MII/RMII 10/100 Ethernet Transceiver with flexPWR Technology; Manufacturer: Microchip; Manufacturer Package Identifier: 24-S4QFN-4x4B-0.5P; Data Rate: 100Mbps; Max Supply Current: 21mA; Max Supply Voltage: 3.6V; Min Supply Voltage: 1.08V; Number of Channels: 1; Operating Supply Voltage: 1.2V; Simplex/Duplex: Full Duplex; Supplier 1: Arrow Electronics; Manufacturer Part Number: LAN8720AI-CP-TR-ABC; RoHS: Compliant; Category: Ethernet Interface ICs; Stock 1: 10000; Pricing 1: 5000=0,9425 (USD); Projected EOL Date: 2039-02-06; Ambient Temperature Range High: 85°C; Case/Package: QFN; Country of Assembly: Taiwan, Thailand; Country of Fabrication: Singapore; Country of Origin: Taiwan, Thailand; Export Control Classification Number (ECCN) Code: EAR99; Height: 1mm; Harmonized Tariff Schedule (HTS) Code: 8542.39.0060; Interface: Ethernet; Lifecycle Status: Production; Max Operating Temperature: 85°C; Min Operating Temperature: 0°C; Mount: Surface Mount; Number of Pins: 24; Number of Transceivers: 1; Packaging: Tape & Reel (TR); Weight: 928.191737mg; ComponentLink1URL: https://datasheet.octopart.com:443/LAN8720AI-CP-TR-ABC-Microchip-datasheet-78862000.pdf?src-supplier=Microchip; ComponentLink1Description: https://datasheet.octopart.com:443/LAN8720AI-CP-TR-ABC-Microchip-datasheet-78862000.pdf?src-supplier=Microchip; ComponentLink2URL: https://datasheet.octopart.com:443/LAN8720AI-CP-TR-ABC-Microchip-datasheet-176591424.pdf?src-supplier=Microchip; ComponentLink2Description: https://datasheet.octopart.com:443/LAN8720AI-CP-TR-ABC-Microchip-datasheet-176591424.pdf?src-supplier=Microchip; ComponentLink3URL: http://sigma.octopart.com:80/188454385/materials_sheet/Microchip-LAN8720AI-CP-TR-ABC.pdf?src-supplier=Compliance+Statements; ComponentLink3Description: http://sigma.octopart.com:80/188454385/materials_sheet/Microchip-LAN8720AI-CP-TR-ABC.pdf?src-supplier=Compliance+Statements; ComponentLink4URL: http://sigma.octopart.com:80/conflict_mineral_statement/Microchip-company-68.pdf?src-supplier=Compliance+Statements; ComponentLink4Description: http://sigma.octopart.com:80/conflict_mineral_statement/Microchip-company-68.pdf?src-supplier=Compliance+Statements; ComponentLink5URL: http://sigma.octopart.com:80/conflict_mineral_statement/Microchip-company-69.pdf?src-supplier=Compliance+Statements; ComponentLink5Description: http://sigma.octopart.com:80/conflict_mineral_statement/Microchip-company-69.pdf?src-supplier=Compliance+Statements; ComponentLink6URL: http://sigma.octopart.com:80/reach_statement/Microchip-company-70.pdf?src-supplier=Compliance+Statements; ComponentLink6Description: http://sigma.octopart.com:80/reach_statement/Microchip-company-70.pdf?src-supplier=Compliance+Statements; ComponentLink7URL: http://sigma.octopart.com:80/rohs_statement/Microchip-company-71.pdf?src-supplier=Compliance+Statements; ComponentLink7Description: http://sigma.octopart.com:80/rohs_statement/Microchip-company-71.pdf?src-supplier=Compliance+Statements; Supplier Part Number 1: LAN8720AI-CP-TR-ABC
IC4 = MIC6315-26D2UY-TR: Voltage Supervisor, 1V-5.5Vsupp., 2.63V threshold/28 ms delay, Active-Low, Open-Drain, SOT-143-4; Manufacturer: Microchip; Max Junction Temperature (Tj): 125°C; Max Power Dissipation: 320mW; Max Reset Threshold Voltage: 2.7V; Max Supply Voltage: 5.5V; Min Reset Threshold Voltage: 2.56V; Min Supply Voltage: 1V; Nominal Supply Current: 5µA; Number of Elements: 1; Output Current: 20mA; Reset: Active Low; Reset Timeout: 28ms; Watchdog Timer: No; Supplier 1: Arrow Electronics; Manufacturer Part Number: MIC6315-26D2UY-TR; RoHS: Compliant; Category: Voltage Supervisors; Stock 1: 3; Pricing 1: 1=0,3314 (USD); Projected EOL Date: 2034-10-06; Ambient Temperature Range High: 85°C; Case/Package: SOT-143; Country of Assembly: Thailand; Country of Fabrication: United States of America; Country of Origin: Thailand; Export Control Classification Number (ECCN) Code: EAR99; Height: 1.18mm; Harmonized Tariff Schedule (HTS) Code: 8542.39.0060; Lead Free: Lead Free; Lifecycle Status: Production; Max Operating Temperature: 125°C; Min Operating Temperature: -40°C; Mount: Surface Mount; Number of Outputs: 1; Number of Pins: 4; Number of Voltages Monitored: 1; Power Dissipation: 320mW; REACH SVHC: No; Schedule B: 8542390000, 8542390000|8542390000|8542390000|8542390000|8542390000|8542390000|8542390000|8542390000|8542390000|8542390000|8542390000|8542390000|8542390000|8542390000|8542390000|8542390000|8542390000|8542390000|8542390000|8542390000|8542390000|8542390000|8542390000|85; Threshold Voltage: 2.63V; Type: Simple Reset/Power-On Reset; ComponentLink1URL: https://datasheet.octopart.com:443/MIC6315-26D2UY-TR-Microchip-datasheet-168937229.pdf?src-supplier=Microchip; ComponentLink1Description: https://datasheet.octopart.com:443/MIC6315-26D2UY-TR-Microchip-datasheet-168937229.pdf?src-supplier=Microchip; ComponentLink2URL: https://datasheet.octopart.com:443/MIC6315-26D2UY-TR-Microchip-datasheet-175952328.pdf?src-supplier=Microchip; ComponentLink2Description: https://datasheet.octopart.com:443/MIC6315-26D2UY-TR-Microchip-datasheet-175952328.pdf?src-supplier=Microchip; ComponentLink3URL: https://datasheet.octopart.com:443/MIC6315-26D2UY-TR-Microchip-datasheet-62314919.pdf?src-supplier=SHENGYU+ELECTRONICS; ComponentLink3Description: https://datasheet.octopart.com:443/MIC6315-26D2UY-TR-Microchip-datasheet-62314919.pdf?src-supplier=SHENGYU+ELECTRONICS; ComponentLink4URL: https://datasheet.octopart.com:443/MIC6315-26D2UY-TR-Microchip-datasheet-8328569.pdf?src-supplier=Future+Electronics; ComponentLink4Description: https://datasheet.octopart.com:443/MIC6315-26D2UY-TR-Microchip-datasheet-8328569.pdf?src-supplier=Future+Electronics; ComponentLink5URL: https://datasheet.octopart.com:443/MIC6315-26D2UY-TR-Microchip-datasheet-157246389.pdf?src-supplier=Augswan; ComponentLink5Description: https://datasheet.octopart.com:443/MIC6315-26D2UY-TR-Microchip-datasheet-157246389.pdf?src-supplier=Augswan; ComponentLink6URL: https://datasheet.octopart.com:443/MIC6315-26D2UY-TR-Microchip-datasheet-62289807.pdf?src-supplier=Newark; ComponentLink6Description: https://datasheet.octopart.com:443/MIC6315-26D2UY-TR-Microchip-datasheet-62289807.pdf?src-supplier=Newark; ComponentLink7URL: http://sigma.octopart.com:80/188455532/materials_sheet/Microchip-MIC6315-26D2UY-TR.pdf?src-supplier=Compliance+Statements; ComponentLink7Description: http://sigma.octopart.com:80/188455532/materials_sheet/Microchip-MIC6315-26D2UY-TR.pdf?src-supplier=Compliance+Statements; ComponentLink8URL: http://sigma.octopart.com:80/conflict_mineral_statement/Microchip-company-68.pdf?src-supplier=Compliance+Statements; ComponentLink8Description: http://sigma.octopart.com:80/conflict_mineral_statement/Microchip-company-68.pdf?src-supplier=Compliance+Statements; ComponentLink9URL: http://sigma.octopart.com:80/conflict_mineral_statement/Microchip-company-69.pdf?src-supplier=Compliance+Statements; ComponentLink9Description: http://sigma.octopart.com:80/conflict_mineral_statement/Microchip-company-69.pdf?src-supplier=Compliance+Statements; ComponentLink10URL: http://sigma.octopart.com:80/reach_statement/Microchip-company-70.pdf?src-supplier=Compliance+Statements; ComponentLink10Description: http://sigma.octopart.com:80/reach_statement/Microchip-company-70.pdf?src-supplier=Compliance+Statements; ComponentLink11URL: http://sigma.octopart.com:80/rohs_statement/Microchip-company-71.pdf?src-supplier=Compliance+Statements; ComponentLink11Description: http://sigma.octopart.com:80/rohs_statement/Microchip-company-71.pdf?src-supplier=Compliance+Statements; Supplier Part Number 1: MIC6315-26D2UY-TR
IC5 = CRYSTAL 50 MHZ: Oscillator, 50Mhz, Hcmos/Ttl, 7Mm X 5Mm Rohs Compliant: Yes |Cts CB3LV-3I-50M000000; Manufacturer: CTS Components; Fall Time: 5ns; Frequency Stability: 50ppm; Load Capacitance: 30pF; Max Supply Voltage: 3.63V; Min Supply Voltage: 2.97V; Operating Supply Voltage: 3.3V; Supplier 1: Future Electronics; Manufacturer Part Number: CB3LV-3I-50M000000; RoHS: Compliant; Category: Crystals; Stock 1: 8000; Pricing 1: 1000=0,61, 2000=0,6, 3000=0,59 (USD); Frequency: 50MHz; Lifecycle Status: Production; Max Operating Temperature: 85°C; Min Operating Temperature: -40°C; Mount: Surface Mount; REACH SVHC: Yes; Rise Time: 5ns; ComponentLink1URL: https://datasheet.octopart.com:443/CB3LV-3I-50M000000-CTS-Components-datasheet-137479626.pdf?src-supplier=IHS; ComponentLink1Description: https://datasheet.octopart.com:443/CB3LV-3I-50M000000-CTS-Components-datasheet-137479626.pdf?src-supplier=IHS; ComponentLink2URL: https://datasheet.octopart.com:443/CB3LV-3I-50M000000-CTS-Components-datasheet-13688483.pdf?src-supplier=ODG+(Origin+Data+Global); ComponentLink2Description: https://datasheet.octopart.com:443/CB3LV-3I-50M000000-CTS-Components-datasheet-13688483.pdf?src-supplier=ODG+(Origin+Data+Global); ComponentLink3URL: https://datasheet.octopart.com:443/CB3LV-3I-50M000000-CTS-Components-datasheet-175646164.pdf?src-supplier=Future+Electronics; ComponentLink3Description: https://datasheet.octopart.com:443/CB3LV-3I-50M000000-CTS-Components-datasheet-175646164.pdf?src-supplier=Future+Electronics
IC6 = 74LVC1G17: 74LVC Series 1.65 to 5.5V Single Schmitt-Trigger Buffer SMT - SOT-25; Manufacturer: Diodes Inc.; Manufacturer Part Number: 74LVC1G17W5-7; High Level Output Current: -32mA; Load Capacitance: 50pF; Logic Function: Buffer, Inverting, Schmitt Trigger; Low Level Output Current: 24mA; Min Supply Voltage: 1.65V; Number of Bits per Element: 1; Operating Supply Current: 10µA; Operating Supply Voltage: 3.3V; Output Current: 32mA; Output Type: TOTEM POLE; Polarity: Non-Inverting; Propagation Delay: 7ns; Quiescent Current: 200µA; Schmitt Trigger Input: Yes; Turn-On Delay Time: 14ns; Supplier 1: Arrow Electronics; RoHS: Compliant; Category: Logic Gates; Stock 1: 108000; Pricing 1: 3000=0,0268 (USD); Case/Package: SOT-25; China RoHS: Compliant; Contact Plating: Tin; Height: 1.3mm; Height - Seated (Max): 1.45mm; Lead Free: Lead Free; Length: 3mm; Lifecycle Status: Production; Max Operating Temperature: 125°C; Max Supply Voltage: 5.5V; Min Operating Temperature: -40°C; Mount: Surface Mount; Number of Channels: 1; Number of Circuits: 1; Number of Elements: 1; Number of Gates: 1; Number of Input Lines: 1; Number of Inputs: 1; Number of Output Lines: 1; Number of Outputs: 1; Number of Pins: 5; Number of Terminals: 5; Radiation Hardening: No; REACH SVHC: Yes; Schedule B: 8542390000, 8542390000|8542390000, 8542390000|8542390000|8542390000, 8542390000|8542390000|8542390000|8542390000; Terminal Pitch: 950µm; Width: 1.6mm; ComponentLink1URL: https://datasheet.octopart.com:443/74LVC1G17W5-7-Diodes-Inc.-datasheet-160640061.pdf?src-supplier=IHS; ComponentLink1Description: https://datasheet.octopart.com:443/74LVC1G17W5-7-Diodes-Inc.-datasheet-160640061.pdf?src-supplier=IHS; ComponentLink2URL: https://datasheet.octopart.com:443/74LVC1G17W5-7-Diodes-Inc.-datasheet-46750521.pdf?src-supplier=Newark; ComponentLink2Description: https://datasheet.octopart.com:443/74LVC1G17W5-7-Diodes-Inc.-datasheet-46750521.pdf?src-supplier=Newark; ComponentLink3URL: https://datasheet.octopart.com:443/74LVC1G17W5-7-Diodes-Inc.-datasheet-10411288.pdf?src-supplier=Newark; ComponentLink3Description: https://datasheet.octopart.com:443/74LVC1G17W5-7-Diodes-Inc.-datasheet-10411288.pdf?src-supplier=Newark; ComponentLink4URL: https://datasheet.octopart.com:443/74LVC1G17W5-7-Diodes-Inc.-datasheet-10127066.pdf?src-supplier=Newark; ComponentLink4Description: https://datasheet.octopart.com:443/74LVC1G17W5-7-Diodes-Inc.-datasheet-10127066.pdf?src-supplier=Newark; ComponentLink5URL: http://sigma.octopart.com:80/15540767/rohs_statement/Diodes-Inc.-74LVC1G17W5-7.pdf?src-supplier=Compliance+Statements; ComponentLink5Description: http://sigma.octopart.com:80/15540767/rohs_statement/Diodes-Inc.-74LVC1G17W5-7.pdf?src-supplier=Compliance+Statements; Supplier Part Number 1: 74LVC1G17W5-7
J2 = HanRun - HR911105A: HanRun 8P8C RJ45